# EasyEDA Pro project ProDoc_24G_HOST_2026-09-22.epro

# Schematic Schematic1_3
Assembly Variant: Basic; Board Name: Board1; Create Date: 2026-04-25; Page Name: P1; Project Name: RF24Recv; Schematic Name: Schematic1; Update Date: 2026-04-25; BladeWidth: 10; Company: 嘉立创EDA; Page Size: A4; RegionStart: 1; ShowBorder: 1; TitleBlock: 1; TitleBlockPosition: 3; Version: V1.0; XRegionCount: 6; YRegionCount: 4
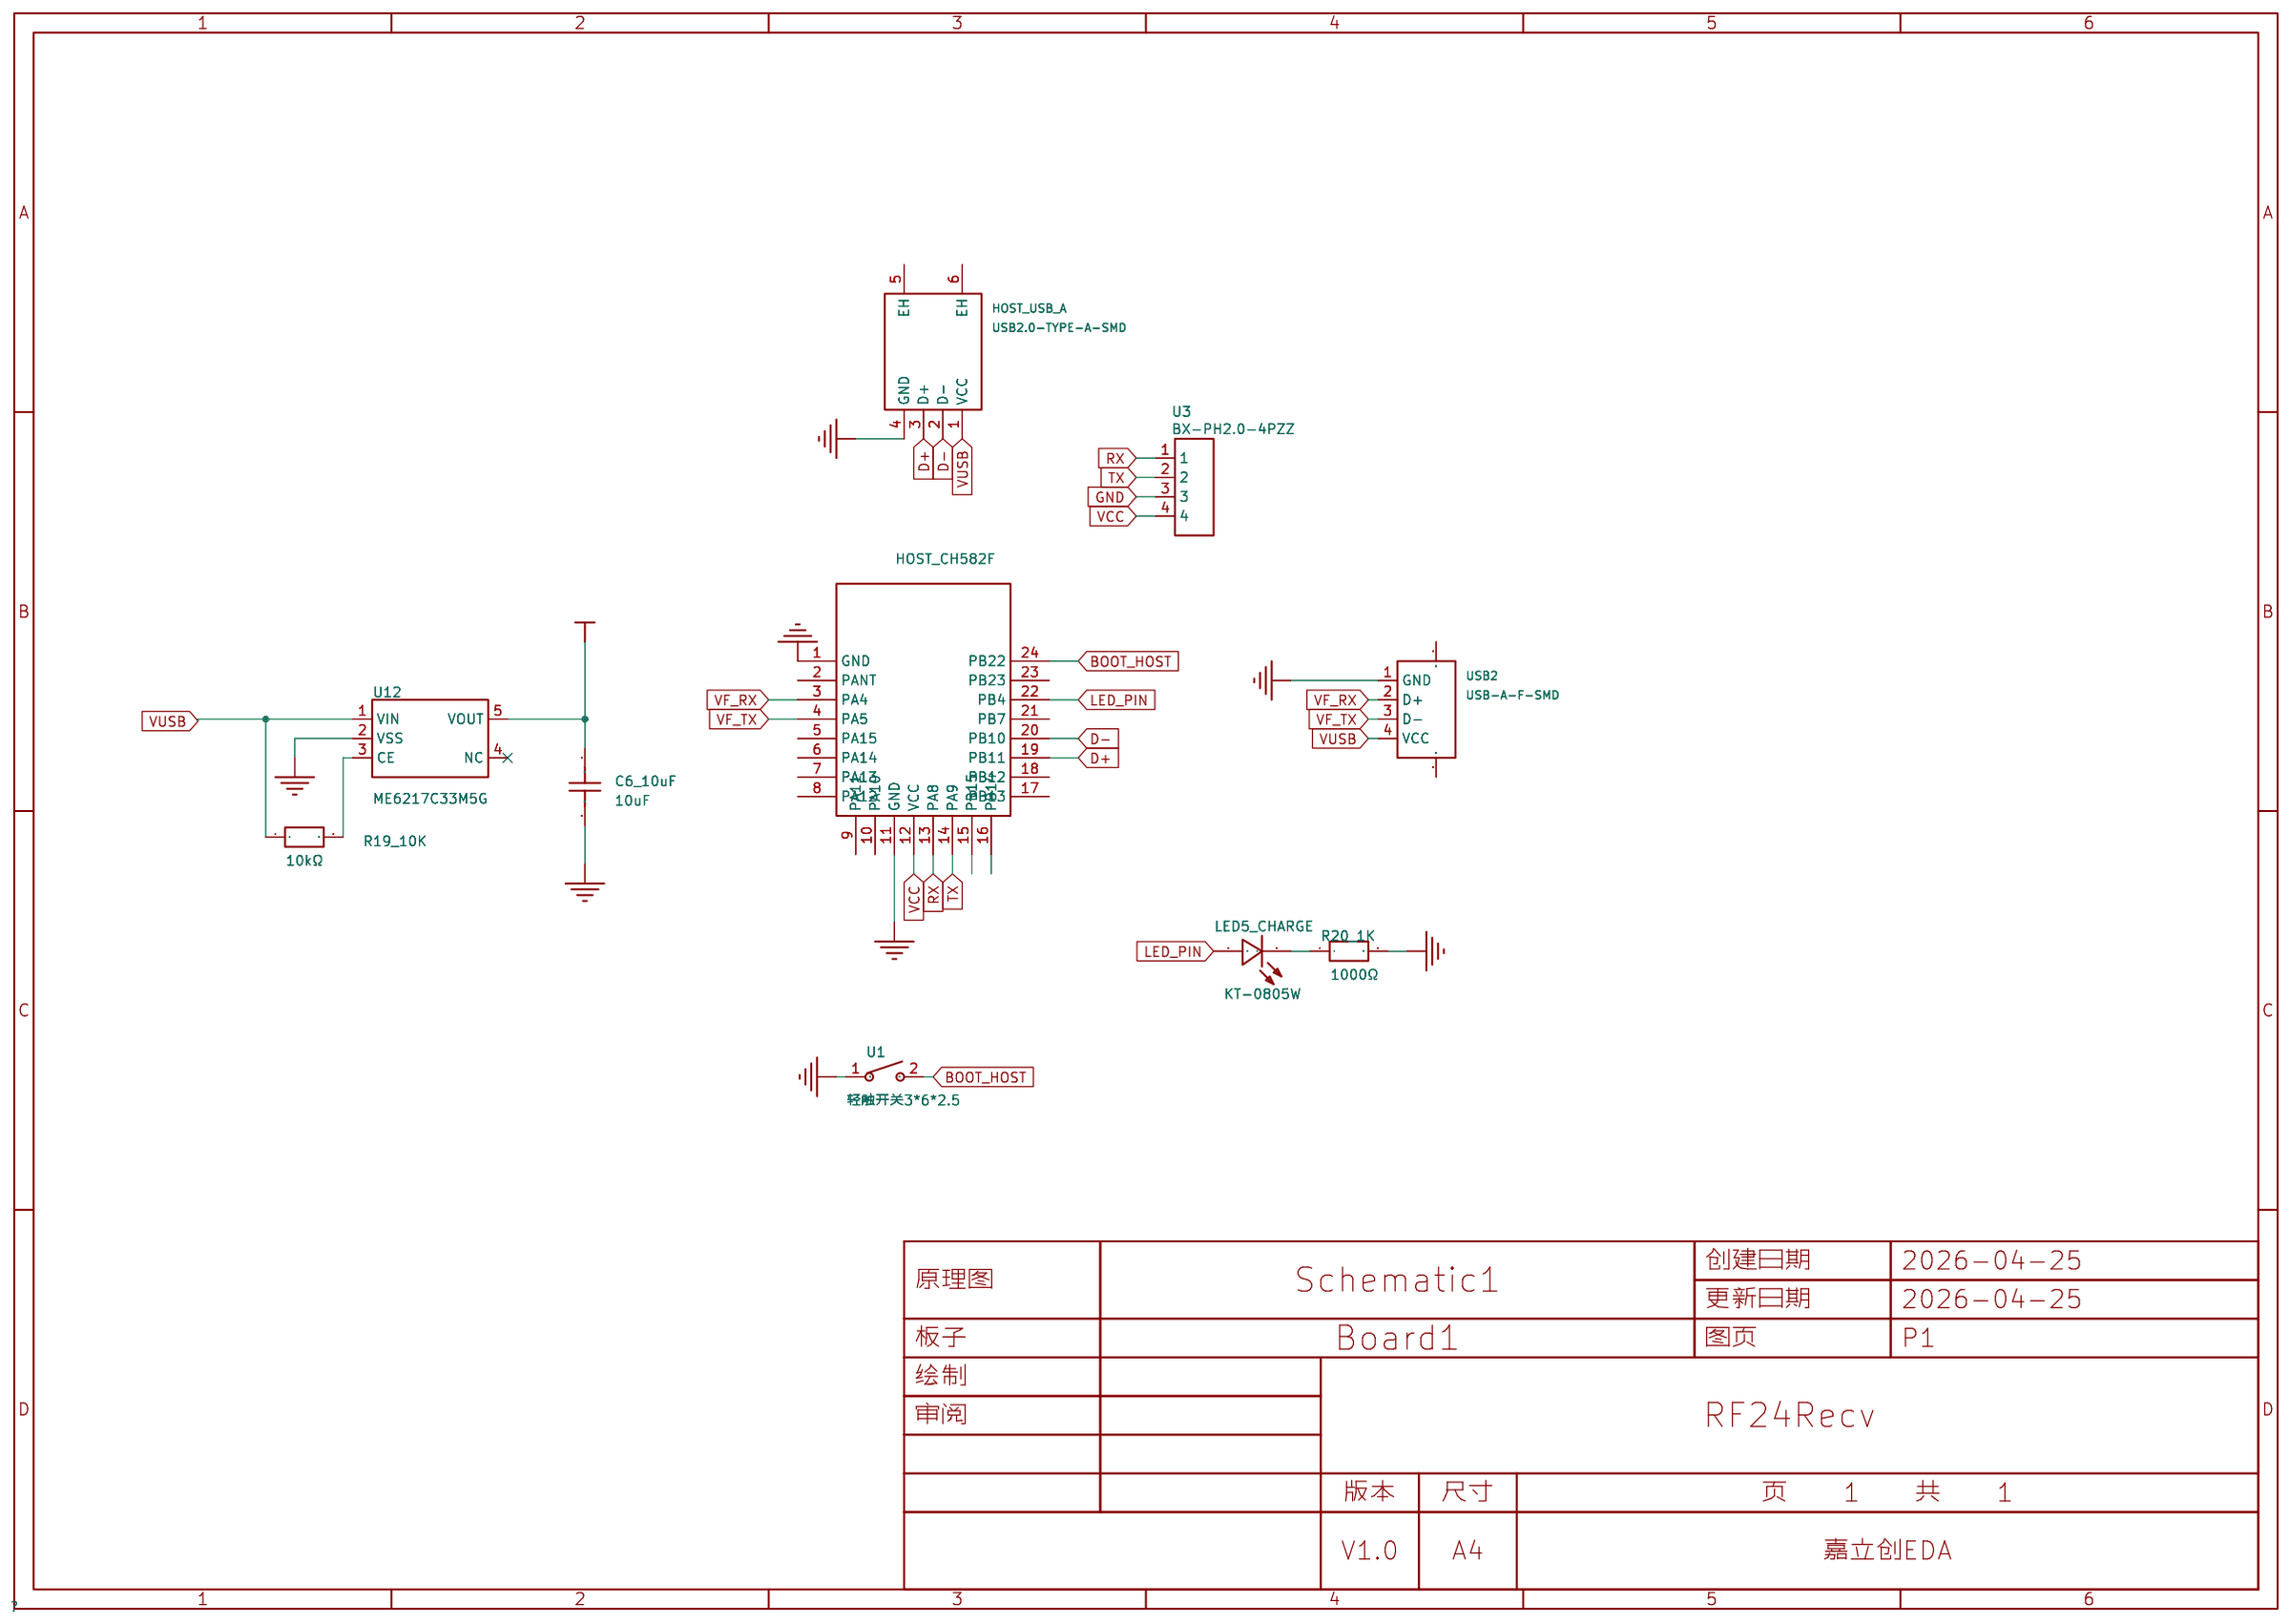
[diagram p0: schematic sheet]

## Parts
C6_10uF  10uF  [C0805]
HOST_CH582F  -  [ch582f]
HOST_USB_A  USB2.0-TYPE-A-SMD  [USB2.0-TYPE-A-4P-SMD]
LED5_CHARGE  KT-0805W  [LED0805-R-RD]
R19_10K  10kΩ  [R0805]
R20_1K  1000Ω  [R0805]
U1  轻触开关3*6*2.5  [SW-SMD_L6.1-W3.6-LS7.9]
U3  BX-PH2.0-4PZZ  [CONN-TH_4P-P2.00_BX-PH2.0-4PZZ]
U12  ME6217C33M5G  [SOT-23-5_L3.0-W1.7-P0.95-LS2.8-BR]
USB2  USB-A-F-SMD  [USB-TYPEA_F_SMD]

## Library data of the parts
C6_10uF = CL21A106KAYNNNE_C15850: 容值:10uF;精度:±10%;额定电压:25V;温度系数:X5R;; LCSC Part Name: 10uF ±10% 25V; Supplier Part: C15850; Manufacturer: SAMSUNG(三星); Manufacturer Part: CL21A106KAYNNNE; Supplier Footprint: 0805; JLCPCB Part Class: 基础库; Datasheet: https://item.szlcsc.com/datasheet/CL21A106KAYNNNE/16532.html; Supplier: LCSC; Tolerance: ±10%; Voltage Rating: 25V; Temperature Coefficient: X5R
HOST_CH582F = ch582f
HOST_USB_A = USB2.0-TYPE-A-SMD: Supplier: LCSC; Supplier Part: C183610; Manufacturer: SOFNG; Manufacturer Part: USB-07; supplierPart: C183610; manufacturer: SOFNG
LED5_CHARGE = KT-0805W: 色温6000K左右; LCSC Part Name: 0805 白灯 高亮; Supplier Part: C34499; Manufacturer: KENTO; Supplier Footprint: 0805; JLCPCB Part Class: 基础库; Datasheet: https://atta.szlcsc.com/upload/public/pdf/source/20221124/DAA20402FFC1FB071B8B6797757426FE.pdf; Supplier: LCSC
R19_10K = 10kΩ: Supplier: LCSC; Supplier Part: C3152217; Manufacturer: Sunway(信维通信); Manufacturer Part: SC0805J1002F4ANRH; JLCPCB Part Class: Extended Part; nameAlias: Value; Contributor: lcsc; spicePre: R; spiceSymbolName: SC0805J1002F4ANRH
R20_1K = TC0525D1000T5E_C44786: 电阻类型:薄膜电阻;阻值:100Ω;精度:±0.5%;功率:250mW;最大工作电压:150V;温度系数:±25ppm/℃;; LCSC Part Name: 100Ω ±0.5% 250mW 薄膜电阻; Supplier Part: C44786; Manufacturer Part: TC0525D1000T5E; Supplier Footprint: 0805; JLCPCB Part Class: 扩展库; Supplier: LCSC; Type: 薄膜电阻; Tolerance: ±0.5%; Power(Watts): 250mW; Overload Voltage (Max): 150V; Temperature Coefficient: ±25ppm/℃
U1 = 轻触开关3*6*2.5: Supplier Part: C9900005901; Supplier Footprint: SMD-2_L6.1-W3.55-LS7.9; JLCPCB Part Class: Extended Part; Supplier: LCSC
U3 = BX-PH2.0-4PZZ: Supplier: LCSC; Supplier Part: C18077746; Manufacturer: Bossie(博锡); JLCPCB Part Class: Extended Part; spicePre: U; Contributor: lcsc
U12 = ME6217C33M5G: 输出类型:固定;工作电压:6.5V;输出电压:3.3V;输出电流:800mA;电源纹波抑制比(PSRR):65dB@(1kHz);输出极性:正极;; LCSC Part Name: 输入7V 输出3.3V 800mA; Supplier Part: C427602; Manufacturer: MICRONE(南京微盟); Supplier Footprint: SOT-23-5; JLCPCB Part Class: 扩展库; Datasheet: https://item.szlcsc.com/datasheet/ME6217C33M5G/421842.html; Supplier: LCSC; Output Type: 固定; Voltage - Supply: 6.5V; Output Voltage: 3.3V; Output Current: 800mA; Power Supply Rejection Ratio (PSRR): 65dB@(1kHz); Voltage Dropout: 180mV@(300mA); standby current: 100uA; Features: 过热保护；带使能; Operating Temperature: -40℃~+85℃; Output Configuration: 正极; Number of Outputs: 1
USB2 = USB-A-F-SMD: USB-A 母头 贴板

## Nets
GND: C6_10uF.2 HOST_CH582F.1(GND) HOST_CH582F.11(GND) HOST_USB_A.4(GND) R20_1K.2 U1.1 U3.3 U12.2(VSS) USB2.1(GND)
VCC: C6_10uF.1 HOST_CH582F.12(VCC) U3.4 U12.5(VOUT)
BOOT_HOST: HOST_CH582F.24(PB22) U1.2
D+: HOST_CH582F.19(PB11) HOST_USB_A.3(D+)
D-: HOST_CH582F.20(PB10) HOST_USB_A.2(D-)
LED_PIN: HOST_CH582F.22(PB4) LED5_CHARGE.1(A)
RX: HOST_CH582F.13(PA8) U3.1
TX: HOST_CH582F.14(PA9) U3.2
VF_RX: HOST_CH582F.3(PA4) USB2.2(D+)
VF_TX: HOST_CH582F.4(PA5) USB2.3(D-)
VUSB: HOST_USB_A.1(VCC) R19_10K.1 U12.1(VIN) USB2.4(VCC)
$1N72: R19_10K.2 U12.3(CE)
$1N104: LED5_CHARGE.2(K) R20_1K.1

Not connected (* = marked no-connect by the designer): HOST_CH582F 2(PANT) 5(PA15) 6(PA14) 7(PA13) 8(PA12) 9(PA11) 10(PA10) 15(PB15) 16(PB14) 17(PB13) 18(PB12) 21(PB7) 23(PB23); HOST_USB_A 5(EH) 6(EH); U12 4(NC)*; USB2 5(GND) 6(GND)

# Board PCB1_3
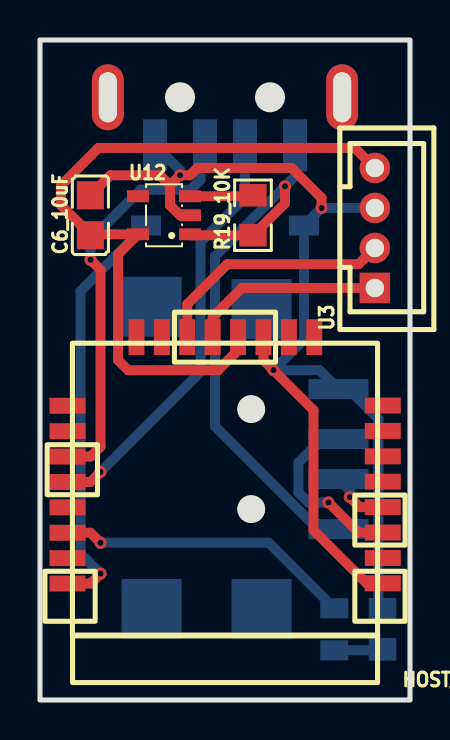
[diagram p1: board, top side]
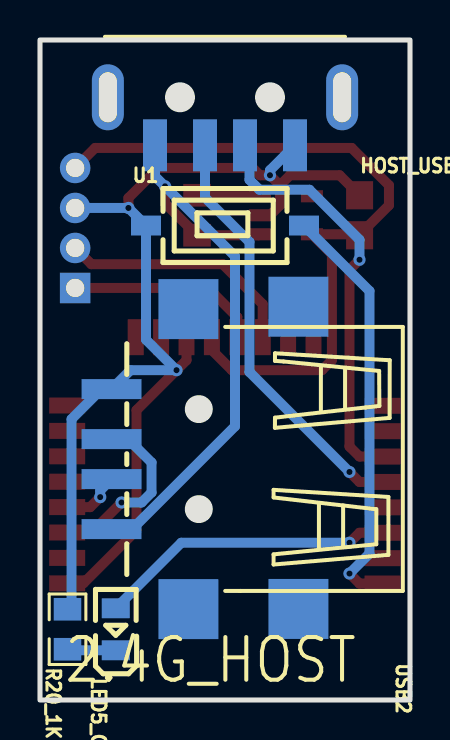
[diagram p2: board, bottom side, seen from below]

Outline 18.5 x 33 mm; copper layers: Top Layer, Bottom Layer. Coordinates in mm from the lower left corner of the outline.
Outline path: rectangle 0,33 18.5,0
Stack: Top Layer 0.035mm / Dielectric1 1.51mm FR4 er 4.5 / Bottom Layer 0.035mm

## Design rules (mm)
spacing copperThickness1oz (default): track to track 0.102, other pairs 0.152 to 0.3
spacing copperThickness2oz: track to track 0.203, other pairs 0.152 to 0.3
track width copperThickness2oz (default): min 0.5, default 0.5, max 2.54
track width copperThickness1oz: min 0.127, default 0.254, max 2.54
differential pair differentialPair (default): width min 0.127, default 0.254, max 2.54; gap min 0.152, default 0.152
net GND uses copperRegion

## Placement (name value [footprint] x y rotation side)
C6_10uF  10uF  [C0805]  2.52 24.24 90 top
HOST_CH582F  -  [ch582f]  9.25 10.52 180 top
HOST_USB_A  USB2.0-TYPE-A-SMD  [USB2.0-TYPE-A-4P-SMD]  9.25 28.94 0 bottom
LED5_CHARGE  KT-0805W  [LED0805-R-RD]  14.71 3.54 90 bottom
R19_10K  10kΩ  [R0805]  10.65 24.24 90 top
R20_1K  1000Ω  [R0805]  17.12 3.54 90 bottom
U1  轻触开关3*6*2.5  [SW-SMD_L6.1-W3.6-LS7.9]  9.25 23.72 180 bottom
U3  BX-PH2.0-4PZZ  [CONN-TH_4P-P2.00_BX-PH2.0-4PZZ]  16.74 23.6 90 top
U12  ME6217C33M5G  [SOT-23-5_L3.0-W1.7-P0.95-LS2.8-BR]  6.2 24.24 0 top
USB2  USB-A-F-SMD  [USB-TYPEA_F_SMD]  0.36 12.05 90 bottom

## Footprints (pads in the part's own frame, mm; a bottom-side part is the same pattern mirrored in y, then rotated)
C0805
  rect 1.41x1.35 smd: 1(-1,0) 2(1,0)
ch582f
  rect 1.8x0.8 smd: 1(-7.89,4.686) 2(-7.89,3.417) 3(-7.89,2.147) 4(-7.89,0.876) 5(-7.89,-0.394) 6(-7.89,-1.663) 7(-7.89,-2.933) 8(-7.89,-4.204) 17(7.874,-4.191) 18(7.874,-2.921) 19(7.874,-1.651) 20(7.874,-0.381) 21(7.874,0.889) 22(7.874,2.159) 23(7.874,3.429) 24(7.874,4.699)
  rect 0.8x1.8 smd: 9(-4.464,-7.62) 10(-3.194,-7.62) 11(-1.924,-7.62) 12(-0.654,-7.62) 13(0.616,-7.62) 14(1.886,-7.62) 15(3.156,-7.62) 16(4.426,-7.62)
CONN-TH_4P-P2.00_BX-PH2.0-4PZZ
  rect 1.524x1.524 hole 0.914: 1(-3,0)
  round 1.524 hole 0.914: 2(-1,0) 3(1,0) 4(3,0)
LED0805-R-RD
  rect 1x1.399 smd: 1(1.05,0) 2(-1.05,0)
R0805
  rect 1.133x1.377 smd: 1(-1,0) 2(1,0)
SOT-23-5_L3.0-W1.7-P0.95-LS2.8-BR
  rect 1.1x0.6 smd: 1(1.3,-0.95) 2(1.3,0) 3(1.3,0.95) 4(-1.3,0.95) 5(-1.3,-0.95)
SW-SMD_L6.1-W3.6-LS7.9
  rect 1.5x1 smd: 1(-3.95,0) 2(3.95,0)
USB2.0-TYPE-A-4P-SMD
  rect 1.2x2.6 smd: 1(3.5,1.2) 2(1,1.2) 3(-1,1.2) 4(-3.5,1.2)
  oval 1.6x3.3 hole 0.9x2.5: 5(-5.857,-1.2) 6(5.857,-1.2)
USB-TYPEA_F_SMD
  rect 1x3 smd: 1(3.5,14.563) 2(1,14.563) 3(-1,14.563) 4(-3.5,14.563)
  rect 3x3 smd: 5(-7.5,10.72) 6(7.5,10.72) 7(-7.493,5.22) 8(7.62,5.22)

## Nets
As in the schematic.

Pads without a net: HOST_CH582F 2 5 6 7 8 9 10 17 18 21 23; HOST_USB_A 5 6; U12 4; USB2 5 6 7 8

## Via types
v1: diameter 0.61, hole 0.305, Top Layer to Bottom Layer, 10 vias

## Routing (per net, layer and track width the routed paths; a pad name or vN(x,y) marks a point on that pad's centre or on a via; arc(x,y) is an arc through that point)
GND: length 60.8
  Top Layer w0.5: U12.2 7,24.24 6.5,24.74 6.5,25.74 ; HOST_CH582F.1 16.33,5.83 13.67,8.49 13.67,14.49 v1(11.67,16.49) 11.17,16.99 HOST_CH582F.11 ; v1(14.08,24.6) 14.08,25.1 12.58,26.6 7.87,26.6 7.5,26.24 v1(7,26.24) 6.5,25.74 ; 6.5,25.74 6,26.24 3.52,26.24 C6_10uF.2
  Bottom Layer w0.5: v1(7,26.24) 7,26.48 HOST_USB_A.4 ; R20_1K.2 16.92,4.74 16.92,14.05 15.42,15.55 USB2.1 13.98,16.49 v1(11.67,16.49) 13.2,18.02 U1.1 v1(14.08,24.6) U3.3
VCC: length 36.4
  Top Layer w0.5: 2.55,23.24 C6_10uF.1 ; 2.55,23.24 1.05,24.74 1.05,25.74 2.92,27.6 15.74,27.6 U3.4 ; 2.55,23.24 2.6,23.29 U12.5 3.9,22.29 3.9,16.99 4.4,16.49 8.9,16.49 9.9,17.49 HOST_CH582F.12
BOOT_HOST: length 21
  Top Layer w0.5: HOST_CH582F.24 2.53,5.82 v1(3.03,6.32)
  Bottom Layer w0.5: v1(3.03,6.32) 2.03,7.32 2.03,20.45 U1.2
D+: length 21
  Top Layer w0.5: HOST_CH582F.19 2.53,12.17 3.03,12.67 3.03,21.51 v1(2.53,22.01)
  Bottom Layer w0.5: v1(2.53,22.01) 2.53,23.01 5.03,25.51 7.53,25.51 8.03,26.01 8.03,27.51 HOST_USB_A.3
D-: length 21.2
  Top Layer w0.5: HOST_CH582F.20 2.53,10.9 v1(3.03,11.4)
  Bottom Layer w0.5: HOST_USB_A.2 10.25,25.13 8.03,22.9 8.03,16.4 v1(3.03,11.4)
LED_PIN: length 14.9
  Top Layer w0.5: v1(3.03,7.86) 2.53,8.36 HOST_CH582F.22
  Bottom Layer w0.5: LED5_CHARGE.1 11.44,7.86 v1(3.03,7.86)
RX: length 9.7
  Top Layer w0.5: HOST_CH582F.13 8.63,19.14 10.09,20.6 U3.1
TX: length 12.2
  Top Layer w0.5: HOST_CH582F.14 7.36,19.79 9.36,21.79 15.93,21.79 U3.2
VF_RX: length 9
  Top Layer w0.5: HOST_CH582F.3 15.92,8.37 v1(14.42,9.87)
  Bottom Layer w0.5: v1(14.42,9.87) 13.42,9.87 12.92,10.37 12.92,11.87 13.92,12.87 14.75,12.87 USB2.2
VF_TX: length 3
  Top Layer w0.5: HOST_CH582F.4 15.99,9.64 v1(15.49,10.14)
  Bottom Layer w0.5: v1(15.49,10.14) 15.49,10.48 USB2.3
VUSB: length 30.3
  Top Layer w0.5: U12.1 7.55,23.24 R19_10K.1 12.25,24.84 v1(12.25,25.69)
  Bottom Layer w0.5: HOST_USB_A.1 12.75,26.19 v1(12.25,25.69) 8.75,22.19 8.75,13.69 13.89,8.55 USB2.4
$1N72: length 3.2
  Top Layer w0.5: U12.3 10.6,25.19 R19_10K.2
$1N104: length 2.4
  Bottom Layer w0.5: LED5_CHARGE.2 17.07,2.49 R20_1K.1

## Text on the board
Bottom Silkscreen Layer: 2.4G_HOST
